# EAGLE schematic MSSRP-SD_MMC (EAGLE 6.6.0)
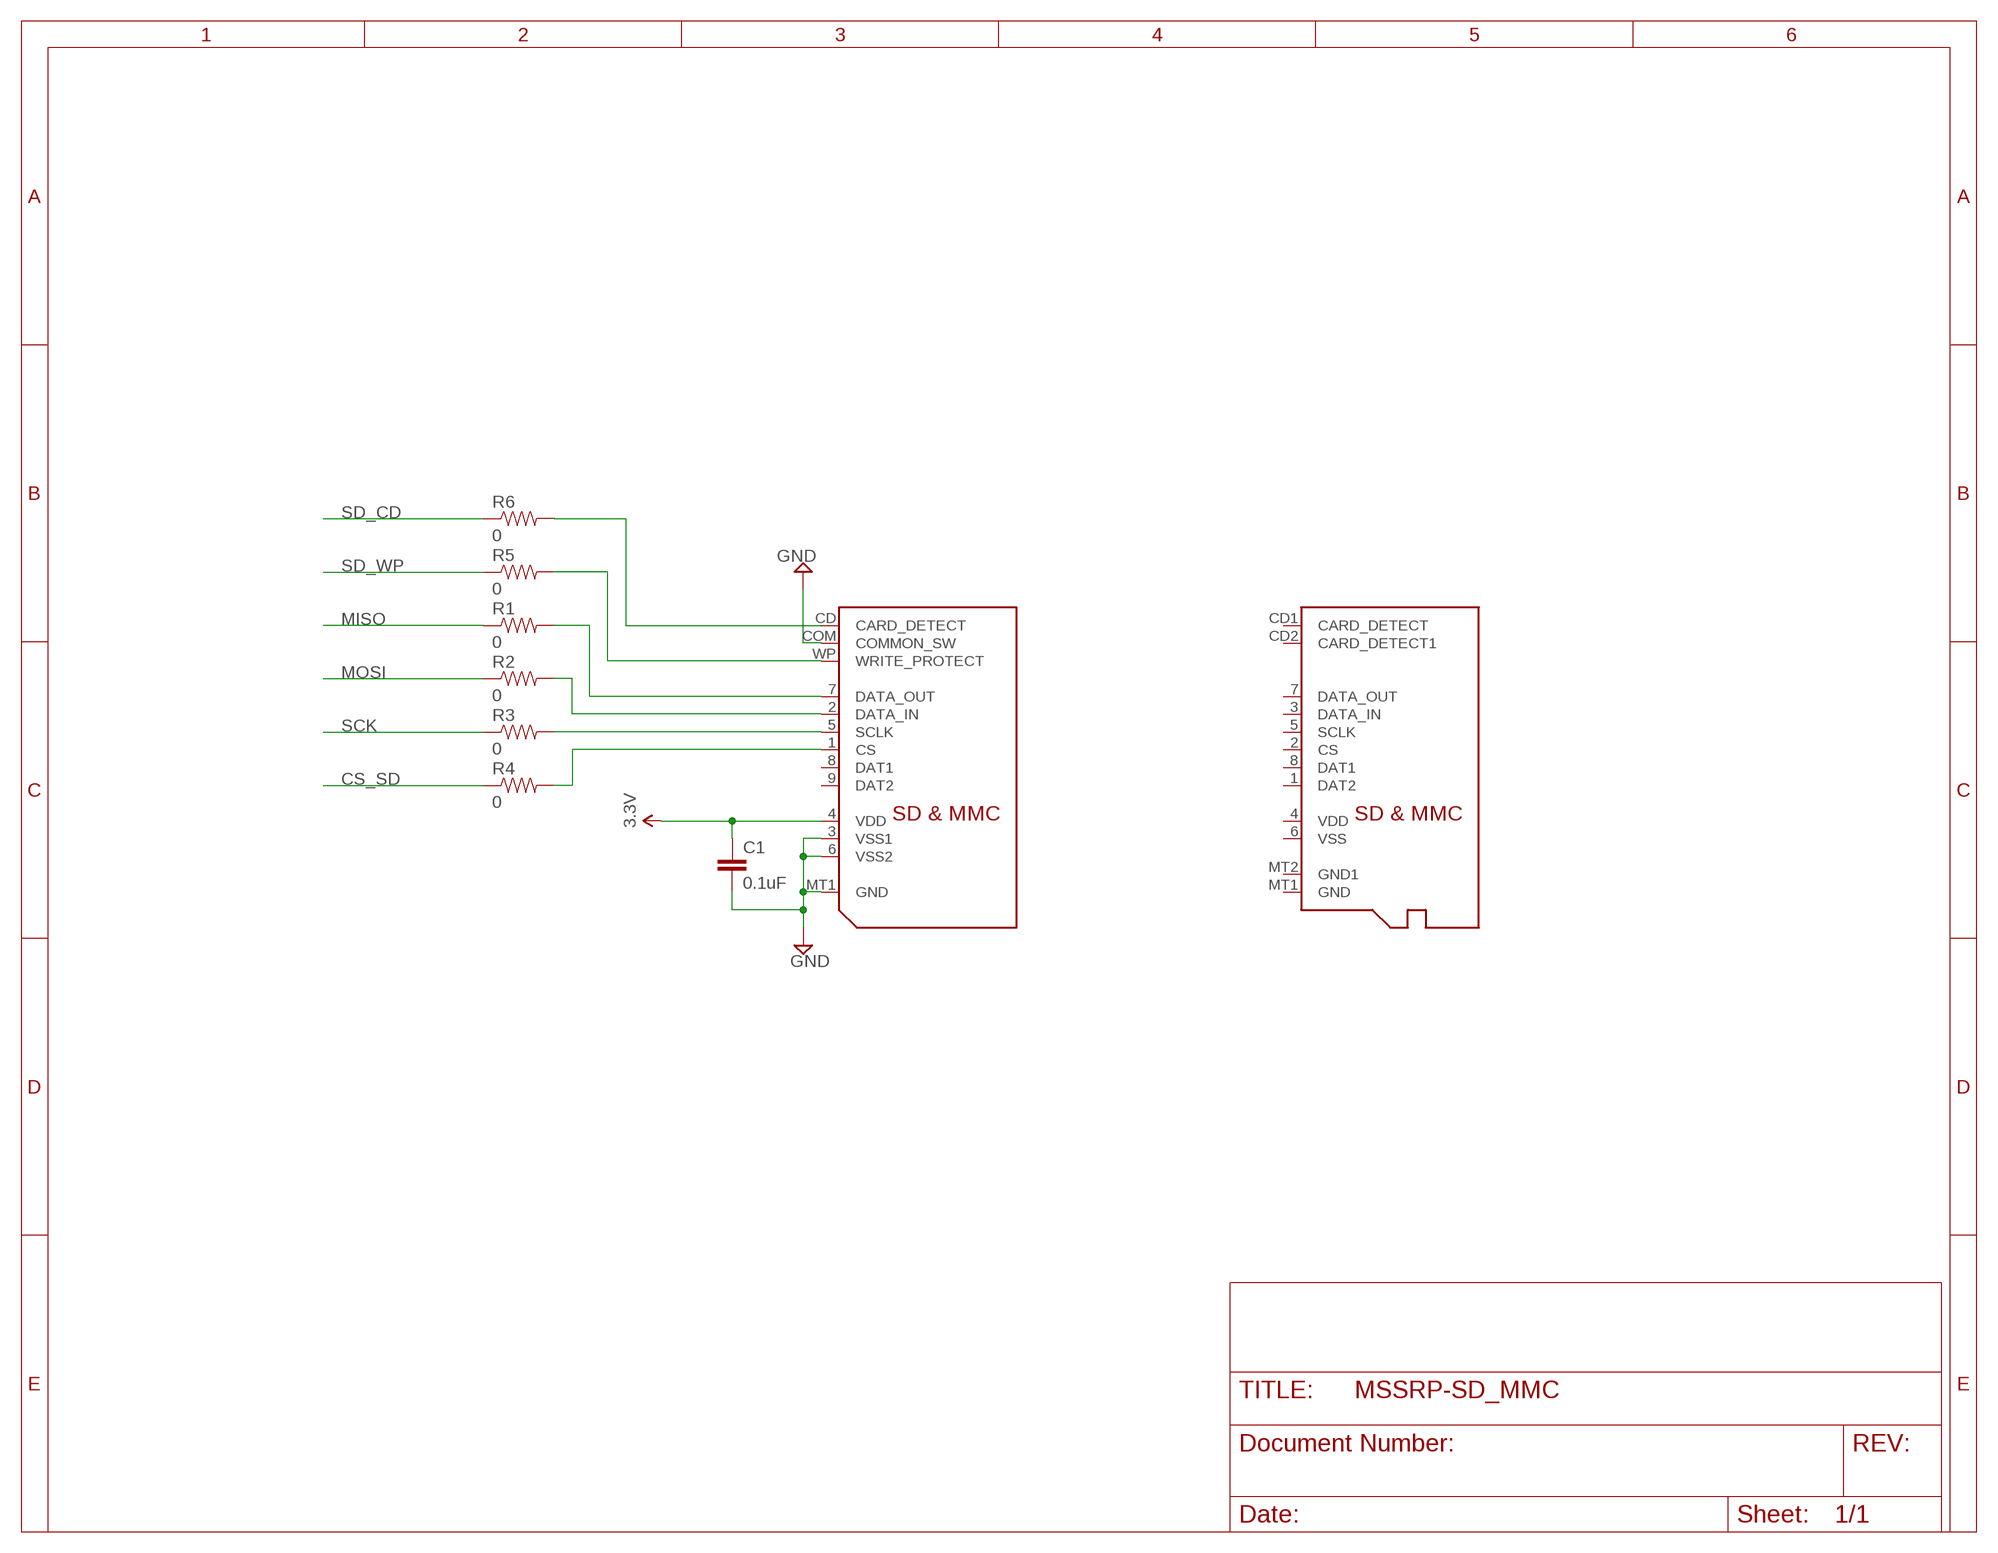
[diagram p0: schematic, sheet 1]

## Parts
C1  0.1uF  0.1UF-25V-5%(0603)  [0603-CAP]
R1  0  0OHM1/10W5%(0603)  [0603]
R2  0  0OHM1/10W5%(0603)  [0603]
R3  0  0OHM1/10W5%(0603)  [0603]
R4  0  0OHM1/10W5%(0603)  [0603]
R5  0  0OHM1/10W5%(0603)  [0603]
R6  0  0OHM1/10W5%(0603)  [0603]
U$1  SDMMC18650  [SDCARD]
U$2  MICROSD  [MICROSD]

## Nets
3.3V: C1.1 U$1.4(VDD)
CS_SD: R4.1
GND: C1.2 U$1.3(VSS1) U$1.6(VSS2) U$1.COM(COMMON_SW) U$1.MT1(GND)
MISO: R1.1
MOSI: R2.1
N$1: R4.2 U$1.1(CS)
N$2: R3.2 U$1.5(SCLK)
N$3: R2.2 U$1.2(DATA_IN)
N$4: R1.2 U$1.7(DATA_OUT)
N$5: R5.2 U$1.WP(WRITE_PROTECT)
N$6: R6.2 U$1.CD(CARD_DETECT)
SCK: R3.1
SD_CD: R6.1
SD_WP: R5.1
Unconnected: U$1.8(DAT1) U$1.9(DAT2) U$2.1(DAT2) U$2.2(CS) U$2.3(DATA_IN) U$2.4(VDD) U$2.5(SCLK) U$2.6(VSS) U$2.7(DATA_OUT) U$2.8(DAT1) U$2.CD1(CARD_DETECT) U$2.CD2(CARD_DETECT1) U$2.MT1(GND) U$2.MT2(GND1)

## Library data of the parts
C1 = SparkFun-Capacitors:0.1UF-25V-5%(0603): CAP-08604; PROD_ID: CAP-08604
R1-R6 = SparkFun-Resistors:0OHM1/10W5%(0603): RES-08609; PROD_ID: RES-08609
U$1 = adafruit:SDMMC: SD MMC Card holder 4UCON part #06132 - easy to solder
U$2 = adafruit:MICROSD: Micro-SD / Transflash card holder with SPI pinout For the 3M # 2908-05WB-MG and/or 4UCON #19656 push-push type